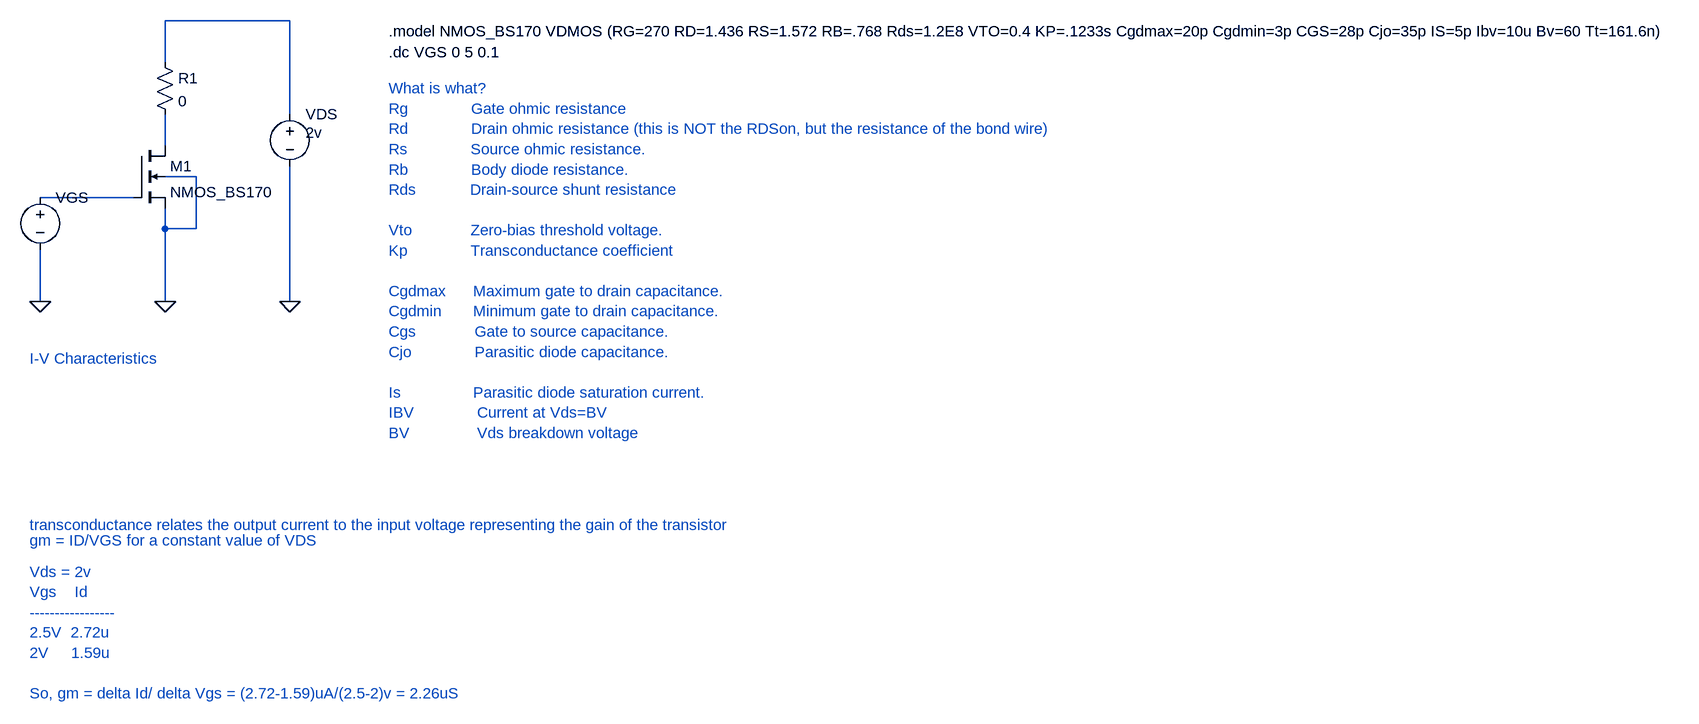
[diagram p0: schematic Draft2.asc]
Draft2.asc, the LTspice schematic file:
Version 4
SHEET 1 2696 952
WIRE 416 -80 224 -80
WIRE 224 -16 224 -80
WIRE 416 64 416 -80
WIRE 224 112 224 64
WIRE 272 160 224 160
WIRE 176 192 32 192
WIRE 224 240 224 208
WIRE 272 240 272 160
WIRE 272 240 224 240
WIRE 32 352 32 272
WIRE 224 352 224 240
WIRE 416 352 416 144
FLAG 224 352 0
FLAG 32 352 0
FLAG 416 352 0
SYMBOL nmos4 176 112 R0
SYMATTR InstName M1
SYMATTR Value NMOS_BS170
SYMATTR Value2 l=1 w=10u
SYMBOL voltage 32 176 R0
SYMATTR InstName VGS
SYMATTR Value ""
SYMBOL voltage 416 48 R0
WINDOW 3 24 44 Left 2
WINDOW 123 0 0 Left 0
WINDOW 39 0 0 Left 0
SYMATTR InstName VDS
SYMATTR Value 2v
SYMBOL res 208 -32 R0
SYMATTR InstName R1
SYMATTR Value 0
TEXT 568 -64 Left 2 !.model NMOS_BS170 VDMOS (RG=270 RD=1.436 RS=1.572 RB=.768 Rds=1.2E8 VTO=0.4 KP=.1233s Cgdmax=20p Cgdmin=3p CGS=28p Cjo=35p IS=5p Ibv=10u Bv=60 Tt=161.6n)
TEXT 568 -32 Left 2 !.dc VGS 0 5 0.1
TEXT 568 24 Left 2 ;What is what?\nRg              Gate ohmic resistance\nRd              Drain ohmic resistance (this is NOT the RDSon, but the resistance of the bond wire)\nRs              Source ohmic resistance.\nRb              Body diode resistance.          \nRds            Drain-source shunt resistance\n \nVto             Zero-bias threshold voltage.\nKp              Transconductance coefficient\n \nCgdmax      Maximum gate to drain capacitance.\nCgdmin       Minimum gate to drain capacitance.\nCgs             Gate to source capacitance.\nCjo              Parasitic diode capacitance.\n \nIs                Parasitic diode saturation current.\nIBV              Current at Vds=BV\nBV               Vds breakdown voltage
TEXT 16 440 Left 2 ;I-V Characteristics
TEXT 16 696 Left 2 ;transconductance relates the output current to the input voltage representing the gain of the transistor
TEXT 16 720 Left 2 ;gm = ID/VGS for a constant value of VDS
TEXT 16 768 Left 2 ;Vds = 2v\nVgs    Id\n-----------------\n2.5V  2.72u\n2V     1.59u\n \nSo, gm = delta Id/ delta Vgs = (2.72-1.59)uA/(2.5-2)v = 2.26uS

The netlist it stands for:
* Draft2.asc
M1 N002 N003 0 0 NMOS_BS170 l=1 w=10u
VGS N003 0
VDS N001 0 2v
R1 N001 N002 0
.model NMOS NMOS
.model PMOS PMOS
.lib standard.mos
.model NMOS_BS170 VDMOS (RG=270 RD=1.436 RS=1.572 RB=.768 Rds=1.2E8 VTO=0.4 KP=.1233s Cgdmax=20p Cgdmin=3p CGS=28p Cjo=35p IS=5p Ibv=10u Bv=60 Tt=161.6n)
.dc VGS 0 5 0.1
* What is what?
* Rg              Gate ohmic resistance
* Rd              Drain ohmic resistance (this is NOT the RDSon, but the resistance of the bond wire)
* Rs              Source ohmic resistance.
* Rb              Body diode resistance.
* Rds            Drain-source shunt resistance
* Vto             Zero-bias threshold voltage.
* Kp              Transconductance coefficient
* Cgdmax      Maximum gate to drain capacitance.
* Cgdmin       Minimum gate to drain capacitance.
* Cgs             Gate to source capacitance.
* Cjo              Parasitic diode capacitance.
* Is                Parasitic diode saturation current.
* IBV              Current at Vds=BV
* BV               Vds breakdown voltage
* I-V Characteristics
* transconductance relates the output current to the input voltage representing the gain of the transistor
* gm = ID/VGS for a constant value of VDS
* Vds = 2v
* Vgs    Id
* -----------------
* 2.5V  2.72u
* 2V     1.59u
* So, gm = delta Id/ delta Vgs = (2.72-1.59)uA/(2.5-2)v = 2.26uS
.backanno
.end